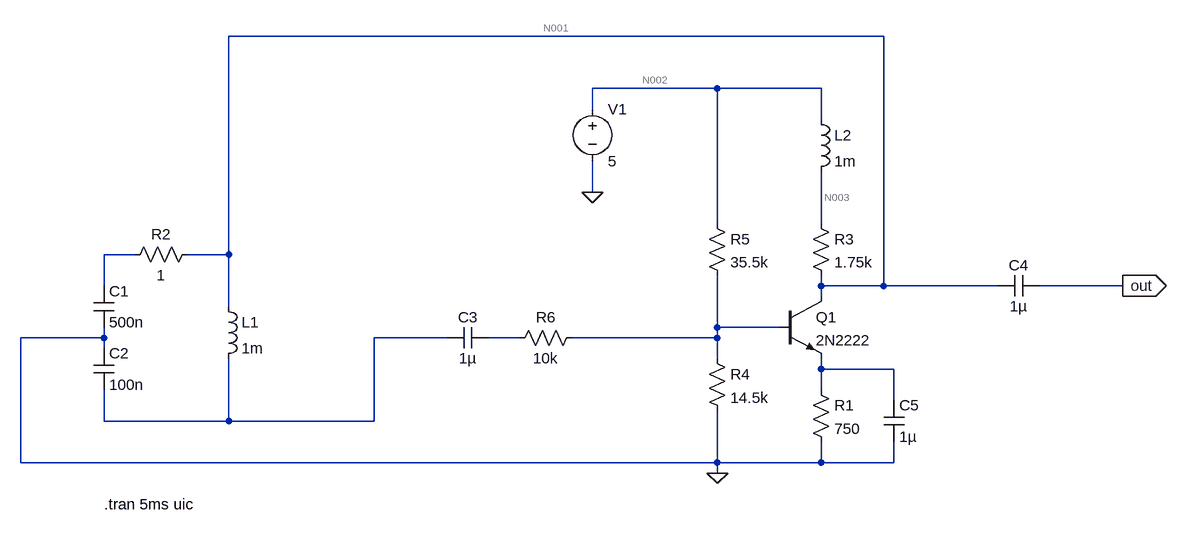
[diagram p0: schematic oscillator.asc]
oscillator.asc, the LTspice schematic file:
Version 4.1
SHEET 1 1776 680
WIRE 1312 -336 304 -336
WIRE 1056 -256 864 -256
WIRE 1216 -256 1056 -256
WIRE 864 -224 864 -256
WIRE 1216 -208 1216 -256
WIRE 864 -96 864 -144
WIRE 1056 -48 1056 -256
WIRE 1216 -48 1216 -128
WIRE 160 0 112 0
WIRE 304 0 304 -336
WIRE 304 0 240 0
WIRE 112 48 112 0
WIRE 1216 48 1216 32
WIRE 1312 48 1312 -336
WIRE 1312 48 1216 48
WIRE 1488 48 1312 48
WIRE 1680 48 1552 48
WIRE 1216 64 1216 48
WIRE 304 80 304 0
WIRE 1056 112 1056 32
WIRE 1152 112 1056 112
WIRE 112 128 112 112
WIRE 112 128 -16 128
WIRE 640 128 528 128
WIRE 752 128 704 128
WIRE 1056 128 1056 112
WIRE 1056 128 832 128
WIRE 112 144 112 128
WIRE 1056 160 1056 128
WIRE 1216 176 1216 160
WIRE 1328 176 1216 176
WIRE 1216 208 1216 176
WIRE 1328 224 1328 176
WIRE 112 256 112 208
WIRE 304 256 304 160
WIRE 304 256 112 256
WIRE 528 256 528 128
WIRE 528 256 304 256
WIRE -16 320 -16 128
WIRE 1056 320 1056 240
WIRE 1056 320 -16 320
WIRE 1216 320 1216 288
WIRE 1216 320 1056 320
WIRE 1328 320 1328 288
WIRE 1328 320 1216 320
WIRE 1056 336 1056 320
FLAG 1056 336 0
FLAG 864 -96 0
FLAG 1680 48 out
IOPIN 1680 48 Out
SYMBOL ind 288 64 R0
SYMATTR InstName L1
SYMATTR Value 1m
SYMBOL cap 96 48 R0
SYMATTR InstName C1
SYMATTR Value 500n
SYMBOL cap 96 144 R0
SYMATTR InstName C2
SYMATTR Value 100n
SYMBOL npn 1152 64 R0
SYMATTR InstName Q1
SYMATTR Value 2N2222
SYMBOL res 1200 192 R0
SYMATTR InstName R1
SYMATTR Value 750
SYMBOL res 256 -16 R90
WINDOW 0 0 56 VBottom 2
WINDOW 3 32 56 VTop 2
SYMATTR InstName R2
SYMATTR Value 1
SYMBOL res 1200 -64 R0
SYMATTR InstName R3
SYMATTR Value 1.75k
SYMBOL res 1040 144 R0
SYMATTR InstName R4
SYMATTR Value 14.5k
SYMBOL res 1040 -64 R0
SYMATTR InstName R5
SYMATTR Value 35.5k
SYMBOL voltage 864 -240 R0
WINDOW 123 0 0 Left 0
WINDOW 39 0 0 Left 0
SYMATTR InstName V1
SYMATTR Value 5
SYMBOL cap 704 112 R90
WINDOW 0 0 32 VBottom 2
WINDOW 3 32 32 VTop 2
SYMATTR InstName C3
SYMATTR Value 1µ
SYMBOL ind 1200 -224 R0
SYMATTR InstName L2
SYMATTR Value 1m
SYMBOL cap 1552 32 R90
WINDOW 0 0 32 VBottom 2
WINDOW 3 32 32 VTop 2
SYMATTR InstName C4
SYMATTR Value 1µ
SYMBOL cap 1312 224 R0
SYMATTR InstName C5
SYMATTR Value 1µ
SYMBOL res 848 112 R90
WINDOW 0 0 56 VBottom 2
WINDOW 3 32 56 VTop 2
SYMATTR InstName R6
SYMATTR Value 10k
TEXT 112 384 Left 2 !.tran 5ms uic

The netlist it stands for:
* oscillator.asc
L1 N001 N006 1m
C1 N004 0 500n
C2 0 N006 100n
Q1 N001 N005 N008 0 2N2222
R1 N008 0 750
R2 N001 N004 1
R3 N003 N001 1.75k
R4 N005 0 14.5k
R5 N002 N005 35.5k
V1 N002 0 5
C3 N007 N006 1µ
L2 N002 N003 1m
C4 out N001 1µ
C5 N008 0 1µ
R6 N005 N007 10k
.model NPN NPN
.model PNP PNP
.lib standard.bjt
.tran 5ms uic
.backanno
.end

* Results of the author's LTspice run, read from the files saved beside the schematic
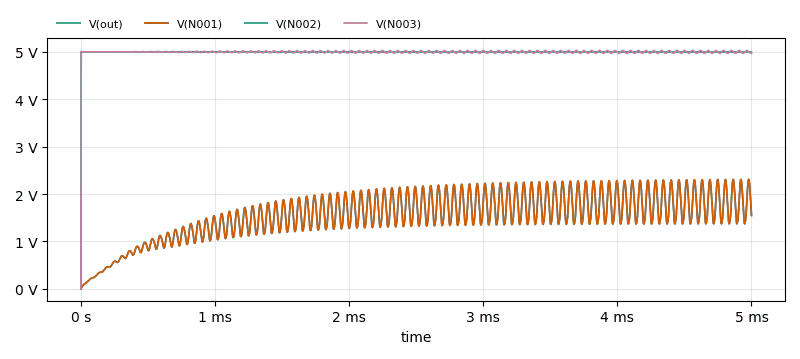
[diagram p1: Transient Analysis of oscillator.asc, plotted from the saved traces]
* Transient Analysis, 1 run:
*   V(out): min 0 V, max 2.31 V, average 1.544 V, rms 1.621 V, last 1.549 V
*   V(N001): min 0 V, max 2.31 V, average 1.544 V, rms 1.621 V, last 1.549 V
*   V(N002): min 0 V, max 5 V, average 5 V, rms 5 V, last 5 V
*   V(N003): min 0 V, max 5.031 V, average 5 V, rms 5 V, last 4.967 V